# EAGLE design 6-pin SOT-23 (EAGLE 6.3)
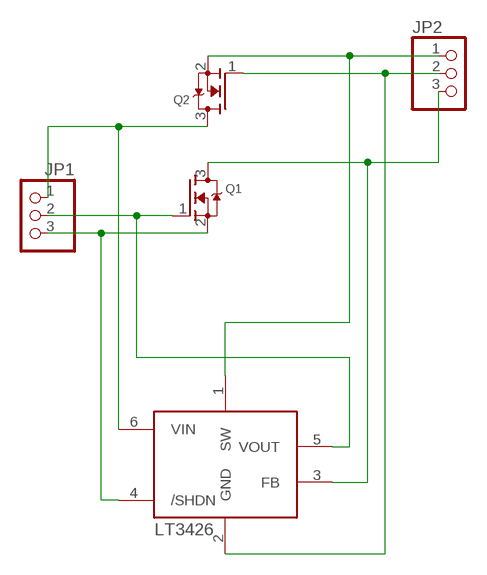
[diagram p0: schematic, sheet 1]

## Parts
JP1  PINHD-1X3CB  [1X03-CLEANBIG]
JP2  PINHD-1X3CB  [1X03-CLEANBIG]
Q1  MOSFET-NREFLOW  [SOT23]
Q2  MOSFET-NREFLOW  [SOT23]
U$1  LT3426  [SOT23-6]

## Nets
GND: JP2.2 Q2.1(G) U$1.2(GND)
N$1: JP2.3 Q1.3(D) U$1.3(FB)
N$2: JP1.2 Q1.1(G) U$1.5(VOUT)
N$3: JP1.3 Q1.2(S) U$1.4(/SHDN)
N$5: JP2.1 Q2.2(S) U$1.1(SW)
N$6: JP1.1 Q2.3(D) U$1.6(VIN)

## Library data of the parts
JP1 JP2 = adafruit:PINHD-1X3: PIN HEADER
Q1 Q2 = adafruit:MOSFET-N: N-Channel Mosfet 2N7002E - 60V 260mA SOT23 [Digikey: 2N7002ET1GOSTR-ND] - REEL BSH103 - 30V 850mA SOT23 [Digikey: 568-5013-1-ND]
U$1 = adafruit:LT3426: LT3426 1.2MHz, 2A boost converter in SOT-23 http://www.linear.com/pc/productDetail.jsp?navId=H0,C1,C1003,C1042,C1031,C1061,P8430 (Linear website)

## Board
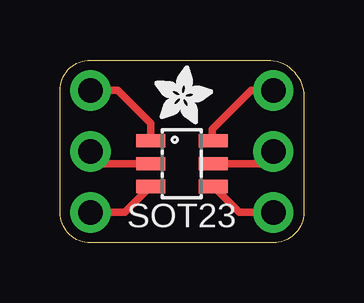
[diagram p1: board, top side]
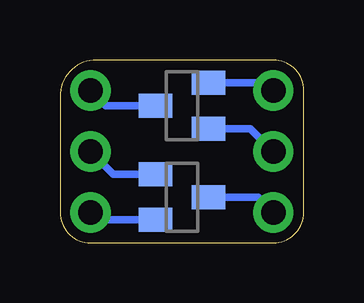
[diagram p2: board, bottom side, seen from below]

Size 10.16 x 7.62 mm. Coordinates in mm from the lower left corner, seen from the top.
Outline: 0,1.27 0,6.35 arc-90 1.27,7.62 8.64,7.62 arc-90 10.16,6.1 10.16,1.27 arc-90 8.89,0 1.27,0 arc-90 0,1.27
Copper layers (1*16): Top 0.035mm / dielectric 1.5mm / Bottom 0.035mm
Design rules "default": minimum track width 10mil, minimum drill 16mil, track to track 8mil, track to pad 8mil, pad to pad 8mil, via to via 8mil, smd to smd 8mil, copper to edge 10mil, drill to drill 8mil, minimum pad ring 10mil, minimum via ring 8mil, stop-mask expansion 4mil, vias tented up to drill 20mil, thermal gap 10mil

### Footprints (pad centres in the part's own frame; a part is rotated, then mirrored left to right if it is on the bottom)
1X03-CLEANBIG = drill 1.016 pad 1.676: 1 -2.54,0; 2 0,0; 3 2.54,0
SOT23 = smd 1 x 1.4: 1 -0.95,-1.1; 2 0.95,-1.1; 3 0,1.1
SOT23-6 = smd 0.55 x 1.2: 1 -0.95,-1.3; 2 0,-1.3; 3 0.95,-1.3; 4 0.95,1.3; 5 0,1.3; 6 -0.95,1.3

### Placement (x,y rotation side)
JP1  8.89,3.81 270 top
JP2  1.27,3.81 270 top
Q1  5.08,1.91 270 bottom
Q2  5.08,5.71 90 bottom
U$1  5.08,3.3 270 top
U$2  [ADAFRUIT_2.5MM]  3.94,4.95 0 top

### Tracks (layer width: path | path; a pad name or v marks a point on that pad's centre or on a via)
GND
  Top 0.305: U$1.2 1.78,3.3 1.4,3.68 JP2.2
  Bottom 0.305: Q2.1 2.23,4.76 JP2.2
N$1
  Top 0.305: U$1.3 2.7,1.27 JP2.3
  Bottom 0.305: Q1.3 1.91,1.91 JP2.3
N$2
  Top 0.305: U$1.5 8.38,3.3 JP1.2
  Bottom 0.305: Q1.1 7.94,2.85 JP1.2
N$3
  Top 0.305: U$1.4 7.46,1.27 JP1.3
  Bottom 0.305: Q1.2 8.57,0.96 JP1.3
N$5
  Top 0.305: U$1.1 3.78,4.98 2.41,6.35 JP2.1
  Bottom 0.305: Q2.2 1.58,6.67 JP2.1
N$6
  Top 0.305: U$1.6 6.35,4.45 6.35,4.73 7.97,6.35 JP1.1
  Bottom 0.305: Q2.3 8.25,5.71 JP1.1

### Text on the board
tPlace: SOT23